# Altium schematic sheet POWER_MCU.SchDoc
size A2; SheetNumber: 2; SheetTotal: 2; SPICEModelCacheBKGFQCCC: <root> / <DocumentId>BKGFQCCC</DocumentId> / <CacheFrame Number="0"> / <Model Name="irf9510" Kind="CKT"> / <Text>*IRF9510  MCE  4-2-96 / *100V  4A  1.2 ohms HEXFET pkg:TO-220 2,1,3 / .SUBCKT IRF9510  10 20 40 40 / M1   1  2  3  3  DMOS L=1U W=1U / RD  10  1  .569 / RS  30  3  31M / RG  20  2  37.5 / CGS  2  3  182P / EGD 12  0  1  2  1 / VFB 14  0  0 / FFB  1  2  VFB  1 / CGD 13 14  231P / R1  13  0  1 / D1  12 13  DLIM / DDG 15 14  DCGD / R2  12 15  1 / D2  15  0  DLIM / DSD 10  3  DSUB / LS  30 40  7.5N / .MODEL DMOS PMOS (LEVEL=3 THETA=60M VMAX=208K ETA=2M VTO=-3 KP=.471) / .MODEL DCGD D (CJO=231P VJ=.6 M=.68) / .MODEL DSUB D (IS=16.6N N=1.5 RS=1.18 BV=100 CJO=327P VJ=.8 M=.42 TT=82N) / .MODEL DLIM D (IS=100U) / .ENDS IRF9510</Text> / </Model> / <Model Name="irf1010" Kind="CKT"> / <Text>*IRF1010 MCE 4-2-96 / *55V  75A .014 ohm HEXFET pkg:TO-220 2,1,3 / .SUBCKT IRF1010  10 20 40 40 / M1   1  2  3  3  DMOS L=1U W=1U / RD  10  1  5.65M / RS  30  3  1.35M / RG  20  2  12.1 / CGS  2  3  2.15N / EGD 12  0  2  1  1 / VFB 14  0  0 / FFB  2  1  VFB  1 / CGD 13 14  4.49N / R1  13  0  1 / D1  12 13  DLIM / DDG 15 14  DCGD / R2  12 15  1 / D2  15  0  DLIM / DSD  3 10  DSUB / LS  30 40  7.5N / .MODEL DMOS NMOS (LEVEL=3 THETA=60M VMAX=114K ETA=2M VTO=3 KP=19.4) / .MODEL DCGD D (CJO=4.49N VJ=.6 M=.68) / .MODEL DSUB D (IS=311N N=1.5 RS=8.67M BV=55 CJO=4.08N VJ=.8 M=.42 TT=100N) / .MODEL DLIM D (IS=100U) / .ENDS IRF1010</Text> / </Model> / </CacheFrame> / </root>
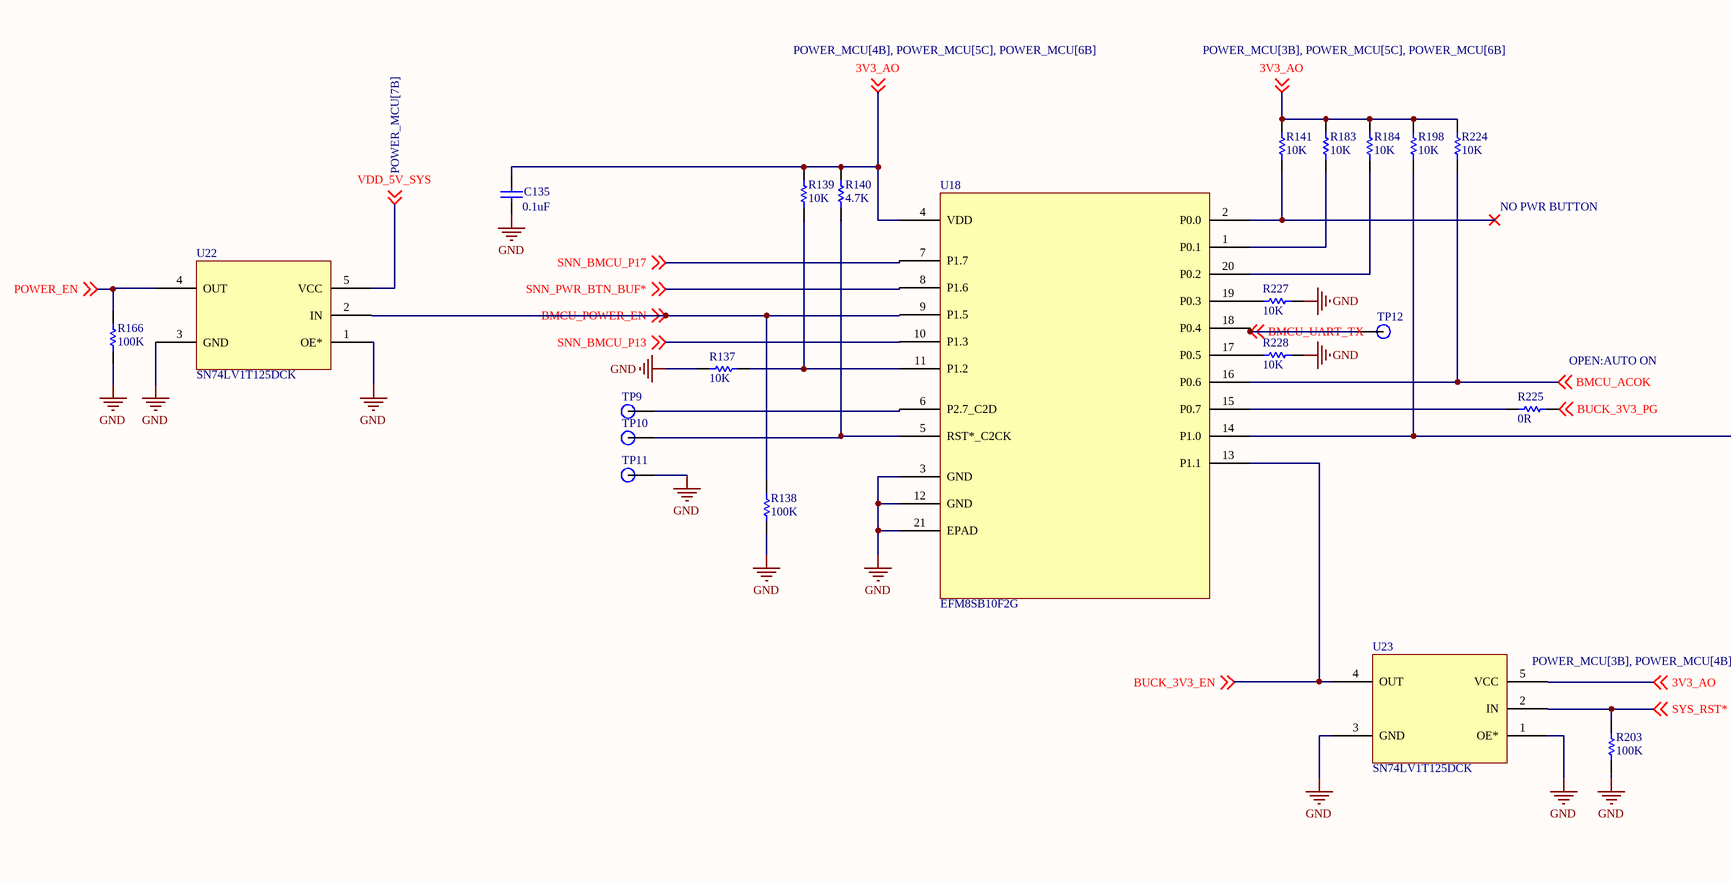
[diagram p0: POWER_MCU.SchDoc, left]
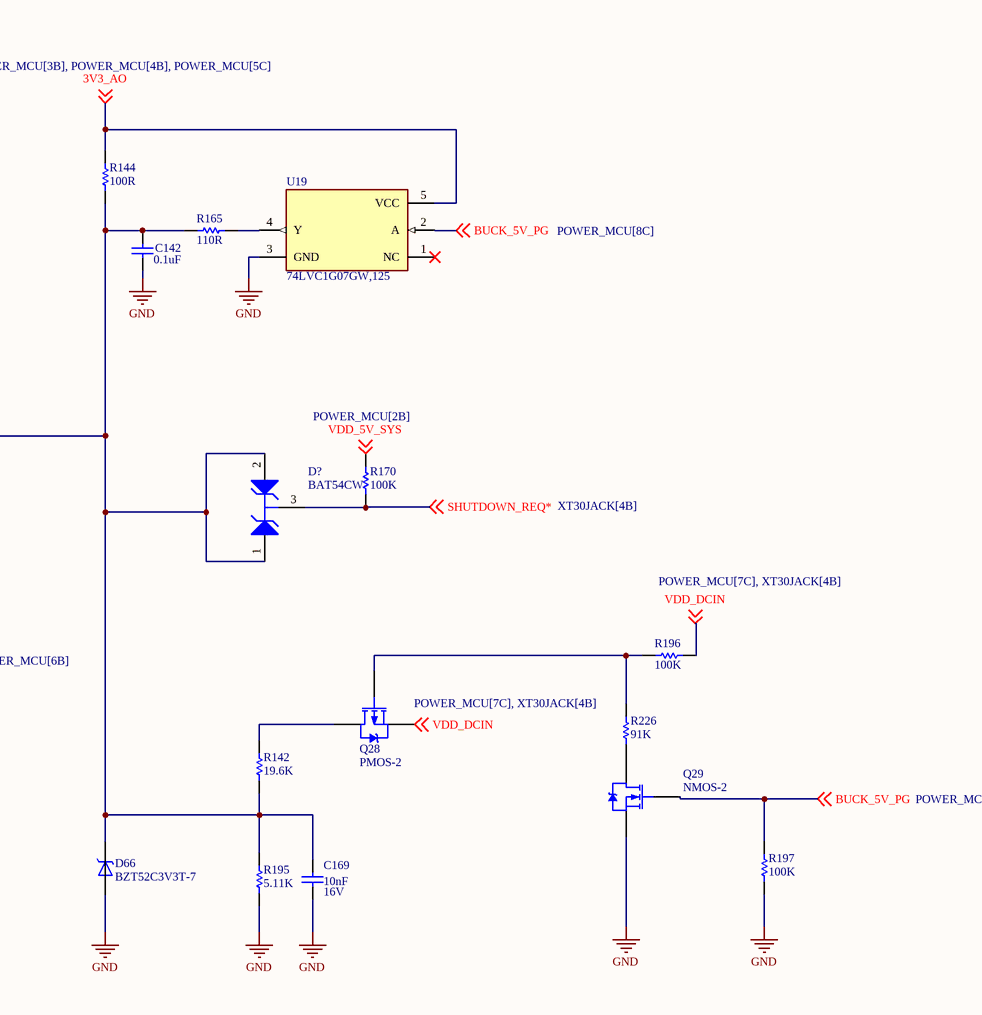
[diagram p1: POWER_MCU.SchDoc, right]

## Parts
C135  0.1uF
C142  0.1uF
C169  Tolerance: 16V  (hidden comment: 10nF)
D66  BZT52C3V3T-7  [SODFL1608X65N]
D?  BAT54CW  [NXP-SOT323-3_L]
Q28  PMOS-2  [TO-220AB]
Q29  NMOS-2  [TO-220AB]
R137  10K
R138  100K
R139  10K
R140  4.7K
R141  10K
R142  19.6K
R144  100R
R165  110R
R166  100K
R170  100K
R183  10K
R184  10K
R195  5.11K
R196  100K
R197  100K
R198  10K
R203  100K
R224  10K
R225  0R
R226  91K
R227  10K
R228  10K
TP9  TP  (value not drawn)
TP10  TP  (value not drawn)
TP11  TP  (value not drawn)
TP12  TP  (value not drawn)
U18  EFM8SB10F2G
U19  74LVC1G07GW,125  [FP-SOT353-1-IPC_C]
U22  SN74LV1T125DCK
U23  SN74LV1T125DCK

## Nets
GND: C135.1 C142.1 C169.1 D66.A Q29.3(S) R137.1 R138.1 R166.1 R195.1 R197.1 R203.1 R227.1 R228.1 TP11.?1 U18.3(GND) U18.12(GND) U18.21(EPAD) U19.3(GND) U22.1(OE*) U22.3(GND) U23.1(OE*) U23.3(GND)
3V3_AO: C135.2 R139.2 R140.2 R141.2 R144.2 R183.2 R184.2 R198.2 R224.2 U18.4(VDD) U19.5(VCC) U23.5(VCC) ; off-sheet 3V3_AO
BMCU_ACOK: R224.1 U18.16(P0.6) ; off-sheet BMCU_ACOK
BMCU_POWER_EN: R138.2 U22.2(IN) ; off-sheet BMCU_POWER_EN
BMCU_UART_TX: TP12.?1 U18.18(P0.4) ; off-sheet BMCU_UART_TX
BUCK_3V3_EN: U18.13(P1.1) U23.4(OUT) ; off-sheet BUCK_3V3_EN
BUCK_3V3_PG: R225.2 ; off-sheet BUCK_3V3_PG
BUCK_5V_PG: Q29.1(G) R197.2 U19.2(A) ; off-sheet BUCK_5V_PG
POWER_EN: R166.2 U22.4(OUT) ; off-sheet POWER_EN
SHUTDOWN_REQ*: D?.3(K) R170.1 ; off-sheet SHUTDOWN_REQ*
SNN_BMCU_P13: U18.10(P1.3) ; off-sheet SNN_BMCU_P13
SNN_BMCU_P17: U18.7(P1.7) ; off-sheet SNN_BMCU_P17
SNN_PWR_BTN_BUF*: U18.8(P1.6) ; off-sheet SNN_PWR_BTN_BUF*
SYS_RST*: R203.2 U23.2(IN) ; off-sheet SYS_RST*
VDD_5V_SYS: R170.2 U22.5(VCC) ; off-sheet VDD_5V_SYS
VDD_DCIN: Q28.3(S) R196.2 ; off-sheet VDD_DCIN
NetC142_2: C142.2 C169.2 D66.C D?.1(A1) D?.2(A2) R142.1 R144.1 R165.1 R195.2 R198.1 U18.14(P1.0)
NetQ28_1: Q28.1(G) R196.1 R226.2
NetQ28_2: Q28.2(D) R142.2
NetR137_2: R137.2 R139.1 U18.11(P1.2)
NetR140_1: R140.1 TP10.?1 U18.5(RST*_C2CK)
NetR141_1: R141.1 U18.2(P0.0)
NetR165_2: R165.2 U19.4(Y)
NetR183_1: R183.1 U18.1(P0.1)
NetR184_1: R184.1 U18.20(P0.2)
NetR225_1: R225.1 U18.15(P0.7)
NetR227_2: R227.2 U18.19(P0.3)
NetR228_2: R228.2 U18.17(P0.5)
NetTP9_?1: TP9.?1 U18.6(P2.7_C2D)

Not connected (* = marked no-connect by the designer): Q29 2(D); R226 1; U18 9(P1.5); U19 1(NC)*

## Notes on the sheet
- NO PWR BUTTON
- (near R225) OPEN:AUTO ON

## Library data of the parts
C135 C142 C169 = Capacitor: Voltage Rating (DC): *
  C135 C142: Tolerance: *; Capacitance: 0.1uF
  C169: Capacitance: 10nF
D66 = BZT52C3V3T-7: Zener Diode 3.3V 300mW Â±6% Surface Mount SOD-523; MF: Diodes Inc.; Availability: Unavailable; MP: BZT52C3V3T-7; Price: None; Value: *; SnapEDA_Link: https://www.snapeda.com/parts/BZT52C3V3T-7/Diodes%20Inc./view-part/523569/?ref=snap; Package: SOD-523 Diodes Inc.
D? = CMP-0417-00001-1: SOT-323 Plastic-Encapsulated Diode; Manufacturer: NXP Semiconductors; Non-repetitive Peak Reverse Current: 600 mA; Max Forward Current: 200 mA; PackageVersion: Mar-06; ComponentLink3URL: http://www.nxp.com/documents/outline_drawing/sot323_po.pdf; Mounting Technology: Surface Mount; ComponentLink3Description: Package Specification; ComponentLink2Description: Datasheet; PartNumber: BAT54CW; Storage Temperature: -65 to 150 degC; DatasheetVersion: Rev. 3, 11/2012; ComponentLink2URL: http://www.nxp.com/documents/data_sheet/BAT54W_SER.pdf; ComponentLink1Description: Manufacturer URL; ComponentLink1URL: http://www.nxp.com/; PackageDescription: 3-Pin SOT323, 2 x 1.3 mm Body, 0.65 mm Pitch; PackageReference: SOT323-3
Q28 = PMOS-2: P-Channel Power MOSFET; Note: Pin 4 not drawn and electrically connected to Pin 2.; Published: 8-Jun-2000; LatestRevisionDate: 17-Jul-2002; LatestRevisionNote: Re-released for DXP Platform.; DatasheetVersion: PD-9.390D; PackageVersion: Feb-1997; PackageReference: TO-220AB; Publisher: Altium Limited; PackageDescription: TO, Thru-Hole, Vertical, Heatsink Mounted; 3 In-Line Leads; Pitch 2.54 mm; ComponentLink1Description: Manufacturer Link; ComponentLink1URL: http://www.irf.com/
Q29 = NMOS-2: N-Channel Power MOSFET; Note: Pin 2 is electrically connected to pin 4.; Published: 8-Jun-2000; LatestRevisionDate: 17-Jul-2002; LatestRevisionNote: Re-released for DXP Platform.; DatasheetVersion: PD-9.814; PackageVersion: Feb-1997; PackageReference: TO-220AB; Publisher: Altium Limited; PackageDescription: TO, Thru-Hole, Vertical, Heatsink Mounted; 3 In-Line Leads; Pitch 2.54 mm; ComponentLink1Description: Manufacturer Link; ComponentLink1URL: http://www.irf.com/
R137-R142 R144 R165 R166 R170 R183 R184 R195-R198 R203 R224-R228 = Resistor: Power Rating: *; Tolerance: *
  R137 R139 R141 R183 R184 R198 R224 R227 R228: Resistance: 10K
  R138 R166 R170 R196 R197 R203: Resistance: 100K
  R140: Resistance: 4.7K
  R142: Resistance: 19.6K
  R144: Resistance: 100R
  R165: Resistance: 110R
  R195: Resistance: 5.11K
  R225: Resistance: 0R
  R226: Resistance: 91K
U19 = CMP-14350-000009-1: IC BUF NON-INVERT 5.5V 5TSSOP